# EAGLE design sapphire_tx_board (EAGLE 5.11)
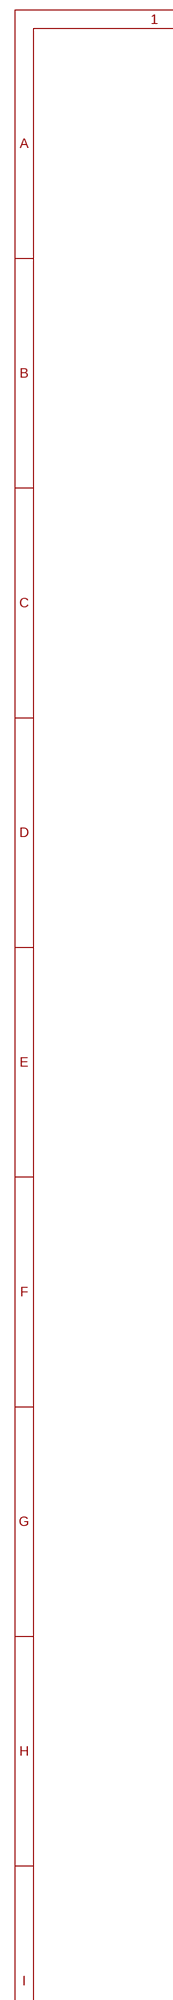
[diagram p0: schematic, sheet 1, part 1 of 2]
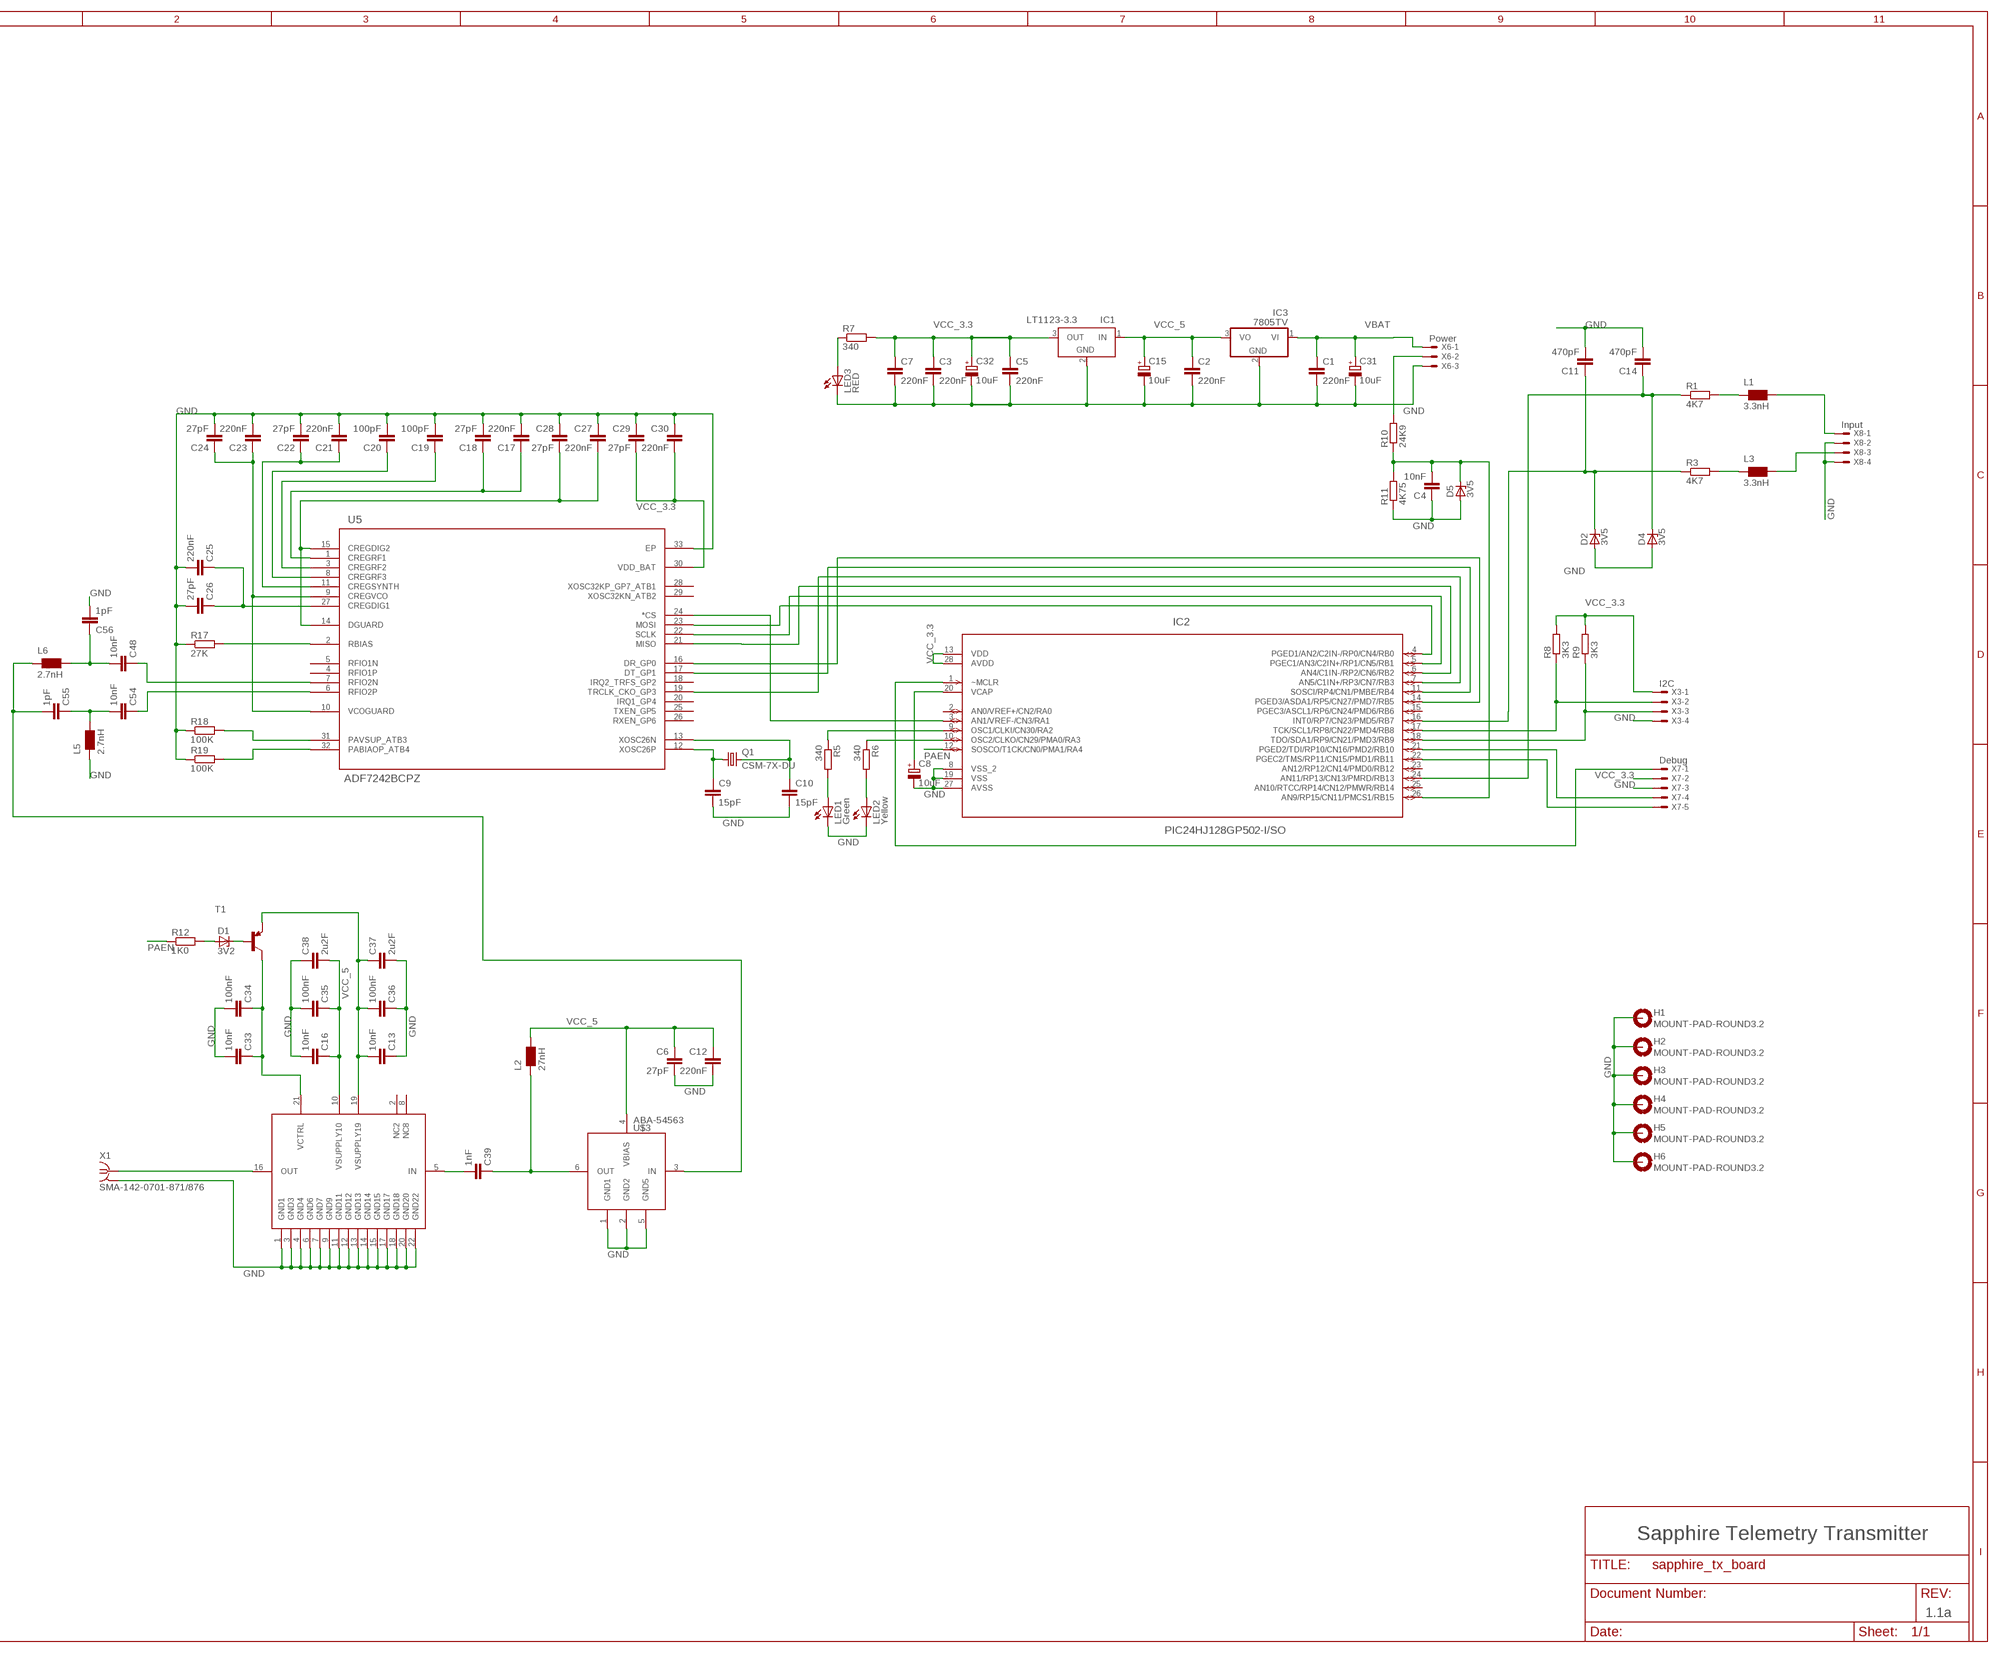
[diagram p1: schematic, sheet 1, part 2 of 2]

## Parts
C1  220nF  C-EUC1206  [C1206]
C2  220nF  C-EUC1206  [C1206]
C3  220nF  C-EUC1206  [C1206]
C4  10nF  C-EUC1206  [C1206]
C5  220nF  C-EUC1206  [C1206]
C6  27pF  C-EUC0603  [C0603]
C7  220nF  C-EUC1206  [C1206]
C8  10uF  CPOL-EUCT6032  [CT6032]
C9  15pF  C-EUC0805  [C0805]
C10  15pF  C-EUC0805  [C0805]
C11  470pF  C-EUC1206  [C1206]
C12  220nF  C-EUC0603  [C0603]
C13  10nF  C-EUC0402  [C0402]
C14  470pF  C-EUC1206  [C1206]
C15  10uF  CPOL-EUCT6032  [CT6032]
C16  10nF  C-EUC0402  [C0402]
C17  220nF  C-EUC0603  [C0603]
C18  27pF  C-EUC0603  [C0603]
C19  100pF  C-EUC0603  [C0603]
C20  100pF  C-EUC0603  [C0603]
C21  220nF  C-EUC0603  [C0603]
C22  27pF  C-EUC0603  [C0603]
C23  220nF  C-EUC0603  [C0603]
C24  27pF  C-EUC0603  [C0603]
C25  220nF  C-EUC0603  [C0603]
C26  27pF  C-EUC0603  [C0603]
C27  220nF  C-EUC0603  [C0603]
C28  27pF  C-EUC0603  [C0603]
C29  27pF  C-EUC0603  [C0603]
C30  220nF  C-EUC0603  [C0603]
C31  10uF  CPOL-EUCT6032  [CT6032]
C32  10uF  CPOL-EUCT6032  [CT6032]
C33  10nF  C-EUC0402  [C0402]
C34  100nF  C-EUC0402  [C0402]
C35  100nF  C-EUC0402  [C0402]
C36  100nF  C-EUC0402  [C0402]
C37  2u2F  C-EUC1206  [C1206]
C38  2u2F  C-EUC1206  [C1206]
C39  1nF  C-EUC0402  [C0402]
C48  10nF  C-EUC0402  [C0402]
C54  10nF  C-EUC0402  [C0402]
C55  1pF  C-EUC0402  [C0402]
C56  1pF  C-EUC0402  [C0402]
D1  3V2  ZENER-DIODESMB  [SMB]
D2  3V5  ZENER-DIODESMB  [SMB]
D4  3V5  ZENER-DIODESMB  [SMB]
D5  3V5  ZENER-DIODESMB  [SMB]
H1  MOUNT-PAD-ROUND3.2  [3,2-PAD]
H2  MOUNT-PAD-ROUND3.2  [3,2-PAD]
H3  MOUNT-PAD-ROUND3.2  [3,2-PAD]
H4  MOUNT-PAD-ROUND3.2  [3,2-PAD]
H5  MOUNT-PAD-ROUND3.2  [3,2-PAD]
H6  MOUNT-PAD-ROUND3.2  [3,2-PAD]
IC1  LT1123-3.3  LT1129CST5  [SOT223]
IC2  PIC24HJ128GP502-I/SO  [SOIC127P1030X265-28N]
IC3  7805TV  [TO220V]
L1  3.3nH  WE-KI_0805_B  [WE-KI_0805_B]
L2  27nH  WE-KI_0402_B  [WE-KI_0402_B]
L3  3.3nH  WE-KI_0805_B  [WE-KI_0805_B]
L5  2.7nH  WE-KI_0402_B  [WE-KI_0402_B]
L6  2.7nH  WE-KI_0402_B  [WE-KI_0402_B]
LED1  Green  LEDCHIPLED_1206  [CHIPLED_1206]
LED2  Yellow  LEDCHIPLED_1206  [CHIPLED_1206]
LED3  RED  LEDCHIPLED_1206  [CHIPLED_1206]
Q1  CSM-7X-DU  [CSM-7X-DU]
R1  4K7  R-EU_M1206  [M1206]
R3  4K7  R-EU_M1206  [M1206]
R5  340  R-EU_R1206  [R1206]
R6  340  R-EU_R1206  [R1206]
R7  340  R-EU_M1206  [M1206]
R8  3K3  R-EU_M1206  [M1206]
R9  3K3  R-EU_M1206  [M1206]
R10  24K9  R-EU_M1206  [M1206]
R11  4K75  R-EU_M1206  [M1206]
R12  1K0  R-EU_R1206  [R1206]
R17  27K  R-EU_M0805  [M0805]
R18  100K  R-EU_M0805  [M0805]
R19  100K  R-EU_M0805  [M0805]
T1  -PNP-SOT23-BCE  [SOT23-BCE]
U5  ADF7242BCPZ  [CP_32_13]
U$3  ABA-54563  [SOT-363]
U$4  ALM-31222  [ALM-31222]
X1  SMA-142-0701-871/876  [J502-ND-142-0701-871/876]
X3  I2C  22-23-2041  [22-23-2041]
X6  Power  22-23-2031  [22-23-2031]
X7  Debug  22-23-2051  [22-23-2051]
X8  Input  22-23-2041  [22-23-2041]

## Nets
3.3V_GPIP171_SPI1_CLK: IC2.7(AN5/C1IN+/RP3/CN7/RB3) U5.19(TRCLK_CKO_GP3)
GND [supply]: C1.2 C2.2 C3.2 C4.1 C5.2 C6.2 C7.2 C8.- C9.2 C10.2 C11.2 C12.2 C13.1 C14.2 C15.- C16.2 C17.2 C18.2 C19.2 C20.2 C21.2 C22.2 C23.2 C24.2 C25.2 C26.2 C27.1 C28.1 C29.1 C30.1 C31.- C32.- C33.2 C34.2 C35.2 C36.1 C37.2 C38.1 C56.2 D2.A D4.A D5.A H1.B3,2(MOUNT) H2.B3,2(MOUNT) H3.B3,2(MOUNT) H4.B3,2(MOUNT) H5.B3,2(MOUNT) H6.B3,2(MOUNT) IC1.2(GND) IC2.8(VSS_2) IC2.19(VSS) IC2.27(AVSS) IC3.2(GND) L5.2 LED1.C LED2.C LED3.C R11.1 R17.1 R18.1 R19.1 U5.33(EP) U$3.1(GND1) U$3.2(GND2) U$3.5(GND5) U$4.1(GND1) U$4.3(GND3) U$4.4(GND4) U$4.6(GND6) U$4.7(GND7) U$4.9(GND9) U$4.11(GND11) U$4.12(GND12) U$4.13(GND13) U$4.14(GND14) U$4.15(GND15) U$4.17(GND17) U$4.18(GND18) U$4.20(GND20) U$4.22(GND22) X1.G@1(GND) X3.4 X6.3 X7.3 X8.2 X8.4
N$1: IC2.14(PGED3/ASDA1/RP5/CN27/PMD7/RB5) U5.16(DR_GP0)
N$2: C10.1 Q1.2 U5.13(XOSC26N)
N$3: IC2.1(~MCLR) X7.1
N$4: IC2.4(PGED1/AN2/C2IN-/RP0/CN4/RB0) U5.23(MOSI)
N$5: IC2.5(PGEC1/AN3/C2IN+/RP1/CN5/RB1) U5.22(SCLK)
N$6: IC2.3(AN1/VREF-/CN3/RA1) U5.24(*CS)
N$7: IC2.21(PGED2/TDI/RP10/CN16/PMD2/RB10) X7.4
N$8: IC2.22(PGEC2/TMS/RP11/CN15/PMD1/RB11) X7.5
N$9: IC2.18(TDO/SDA1/RP9/CN21/PMD3/RB9) R9.1 X3.3
N$10: IC2.17(TCK/SCL1/RP8/CN22/PMD4/RB8) R8.1 X3.2
N$11: IC2.11(SOSCI/RP4/CN1/PMBE/RB4) U5.17(DT_GP1)
N$12: IC2.6(AN4/C1IN-/RP2/CN6/RB2) U5.21(MISO)
N$13: C9.1 Q1.1 U5.12(XOSC26P)
N$14: C14.1 D4.C IC2.24(AN11/RP13/CN13/PMRD/RB13) R1.1
N$15: C39.1 L2.2 U$3.6(OUT)
N$16: C39.2 U$4.5(IN)
N$17: C11.1 D2.C IC2.16(INT0/RP7/CN23/PMD5/RB7) R3.1
N$18: C17.1 C18.1 U5.1(CREGRF1)
N$19: R17.2 U5.2(RBIAS)
N$20: C19.1 U5.3(CREGRF2)
N$21: C20.1 U5.8(CREGRF3)
N$22: C21.1 C22.1 U5.11(CREGSYNTH)
N$23: C23.1 C24.1 U5.9(CREGVCO) U5.10(VCOGUARD)
N$24: C25.1 C26.1 U5.27(CREGDIG1)
N$25: C27.2 C28.2 U5.14(DGUARD) U5.15(CREGDIG2)
N$26: R18.2 U5.31(PAVSUP_ATB3)
N$27: R19.2 U5.32(PABIAOP_ATB4)
N$28: L3.2 R3.2
N$29: U$4.16(OUT) X1.1
N$30: IC2.10(OSC2/CLKO/CN29/PMA0/RA3) R6.1
N$31: IC2.9(OSC1/CLKI/CN30/RA2) R5.1
N$32: L1.1 X8.1
N$33: C8.+ IC2.20(VCAP)
N$34: C13.2 C36.2 C37.1 T1.E U$4.19(VSUPPLY19)
N$35: L3.1 X8.3
N$36: D1.C T1.B
N$37: C4.2 D5.C IC2.26(AN9/RP15/CN11/PMCS1/RB15) R10.1 R11.2
N$38: R10.2 X6.2
N$39: L1.2 R1.2
N$40: C33.1 C34.1 T1.C U$4.21(VCTRL)
N$41: D1.A R12.2
N$42: LED2.A R6.2
N$43: LED1.A R5.2
N$45: LED3.A R7.1
N$46: C48.1 U5.7(RFIO2N)
N$47: C54.1 U5.6(RFIO2P)
N$48: C54.2 C55.1 L5.1
N$49: C48.2 C56.1 L6.1
N$50: C55.2 L6.2 U$3.3(IN)
PAEN: IC2.12(SOSCO/T1CK/CN0/PMA1/RA4) R12.1
VBAT: C1.1 C31.+ IC3.1(VI) X6.1
VCC_3.3 [supply]: C3.1 C5.1 C7.1 C29.2 C30.2 C32.+ IC1.3(OUT) IC2.13(VDD) IC2.28(AVDD) R7.2 R8.2 R9.2 U5.30(VDD_BAT) X3.1 X7.2
VCC_5: C2.1 C6.1 C12.1 C15.+ C16.1 C35.1 C38.2 IC1.1(IN) IC3.3(VO) L2.1 U$3.4(VBIAS) U$4.10(VSUPPLY10)
Unconnected: IC2.2(AN0/VREF+/CN2/RA0) IC2.15(PGEC3/ASCL1/RP6/CN24/PMD6/RB6) IC2.23(AN12/RP12/CN14/PMD0/RB12) IC2.25(AN10/RTCC/RP14/CN12/PMWR/RB14) U5.4(RFIO1P) U5.5(RFIO1N) U5.18(IRQ2_TRFS_GP2) U5.20(IRQ1_GP4) U5.25(TXEN_GP5) U5.26(RXEN_GP6) U5.28(XOSC32KP_GP7_ATB1) U5.29(XOSC32KN_ATB2) U$4.2(NC2) U$4.8(NC8)

## Notes on the sheet
- Sapphire Telemetry Transmitter
- 1.1a

## Power pins joined to a net without a drawn wire
GND: IC1.4(GND) X1.G@2(GND) X1.G@3(GND) X1.G@4(GND)

## Library data of the parts
C1-C7 C9-C14 C16-C30 C33-C39 C48 C54-C56 = resistor:C-EU: CAPACITOR, European symbol
C8 C15 C31 C32 = resistor:CPOL-EU: POLARIZED CAPACITOR, European symbol
D1 D2 D4 D5 = diode:ZENER-DIODE: Z-Diode
H1-H6 = holes:MOUNT-PAD-ROUND: MOUNTING PAD, round
IC1 = linear-technology:LT1129CST5: VOLTAGE REGULATOR with shutdown; MPN: LT1129CST-5#PBF; OC_FARNELL: 1663375; OC_NEWARK: 57M2069
IC2 = Microchip-PIC24HJ127GP502-soic:PIC24HJ128GP502-I/SO: 16-bit Microcontrollers; DESCRIPTION: 16-bit Microcontrollers; MPN: PIC24HJ128GP502-I/SO; OC_FARNELL: 1576880; OC_NEWARK: 40M1488; PACKAGE: SOIC-28; SUPPLIER: Microchip
IC3 = linear:78*: Positive VOLTAGE REGULATOR Source: http://cache.national.com/ds/LM/LM78L05.pdf http://www.fairchildsemi.com/ds/LM/LM7805.pdf
L1-L3 L5 L6 = wuerth-elektronik:WE-KI: SMD Wire Wound Ceramic Inductor WE-KI - Wire wound - High thermal stability - Rated current up to 1 A - High Q-factor - High SRF -- Especially developed for high frequency applications -- Perfect for applications in telecommunications -- Bluetooth -- Wireless LAN
LED1-LED3 = led:LED: LED OSRAM: - CHIPLED LG R971, LG N971, LY N971, LG Q971, LY Q971, LO R971, LY R971 LH N974, LH R974 LS Q976, LO Q976, LY Q976 LO Q996 - Hyper CHIPLED LW Q18S LB Q993, LB Q99A, LB R99A - SideLED LS A670, LO A670, LY A670, LG A670, LP A670 LB A673, LV A673, LT A673, LW A673 LH A674 LY A675 LS A676, LA A676, LO A676, LY A676, LW A676 LS A679, LY A679, LG A679 - Hyper Micro SIDELED® LS Y876, LA Y876, LO Y876, LY Y876 LT Y87S - SmartLED LW L88C, LW L88S LB L89C, LB L89S, LG L890 LS L89K, LO L89K, LY L89K LS L896, LA L896, LO L896, LY L896 - TOPLED LS T670, LO T670, LY T670, LG T670, LP T670 LSG T670, LSP T670, LSY T670, LOP T670, LYG T670 LG T671, LOG T671, LSG T671 LB T673, LV T673, LT T673, LW T673 LH T674 LS T676, LA T676, LO T676, LY T676, LB T676, LH T676, LSB T676, LW T676 LB T67C, LV T67C, LT T67C, LS T67K, LO T67K, LY T67K, LW E67C LS E67B, LA E67B, LO E67B, LY E67B, LB E67C, LV E67C, LT E67C LW T67C LS T679, LY T679, LG T679 LS T770, LO T770, LY T770, LG T770, LP T770 LB T773, LV T773, LT T773, LW T773 LH T774 LS E675, LA E675, LY E675, LS T675 LS T776, LA T776, LO T776, LY T776, LB T776 LHGB T686 LT T68C, LB T68C - Hyper Mini TOPLED® LB M676 - Mini TOPLED Santana® LG M470 LS M47K, LO M47K, LY M47K Source: http://www.osram.convergy.de LUXEON: - LUMILED® LXK2-PW12-R00, LXK2-PW12-S00, LXK2-PW14-U00, LXK2-PW14-V00 LXK2-PM12-R00, LXK2-PM12-S00, LXK2-PM14-U00 LXK2-PE12-Q00, LXK2-PE12-R00, LXK2-PE12-S00, LXK2-PE14-T00, LXK2-PE14-U00 LXK2-PB12-K00, LXK2-PB12-L00, LXK2-PB12-M00, LXK2-PB14-N00, LXK2-PB14-P00, LXK2-PB14-Q00 LXK2-PR12-L00, LXK2-PR12-M00, LXK2-PR14-Q00, LXK2-PR14-R00 LXK2-PD12-Q00, LXK2-PD12-R00, LXK2-PD12-S00 LXK2-PH12-R00, LXK2-PH12-S00 LXK2-PL12-P00, LXK2-PL12-Q00, LXK2-PL12-R00 Source: www.luxeon.com KINGBRIGHT: KA-3528ASYC Source: www.kingbright.com
Q1 = crystal:CSM-7X-DU: SMD CRYSTAL Source: www.ecsxtal.com .. Crystal 3.6864MHz CSM_7X_DU.PDF; OC_FARNELL: unknown; OC_NEWARK: unknown
R1 R3 R5-R12 R17-R19 = resistor:R-EU_: RESISTOR, European symbol
T1 = transistor:*-PNP-: PNP Transistror
U5 = Analog-ADF7242:ADF7242BCPZ
U$3 = Agilent:ABA-54563
U$4 = Avago:ALM-31222
X1 = con-coax:SMA-: SMA 50 Ohm End Launch Jack Receptacle - Round Contact Johnson Components Source: www.johnsoncomponents.com .. J502-ND.pdf; MF: JOHNSON COMPONENTS; MPN: 142-0701-871; OC_FARNELL: 1339835; OC_NEWARK: 91B6105
X3 X8 = con-molex:22-23-2041: .100" (2.54mm) Center Header - 4 Pin; MF: MOLEX; MPN: 22-23-2041; OC_FARNELL: 1462920; OC_NEWARK: 38C0355
X6 = con-molex:22-23-2031: .100" (2.54mm) Center Header - 3 Pin; MF: MOLEX; MPN: 22-23-2031; OC_FARNELL: 1462950; OC_NEWARK: 30C0862
X7 = con-molex:22-23-2051: .100" (2.54mm) Center Header - 5 Pin; MF: MOLEX; MPN: 22-23-2051; OC_FARNELL: 1462952; OC_NEWARK: 38C9178

## Net classes
4 xxwide: width 0.203 mm

## Board
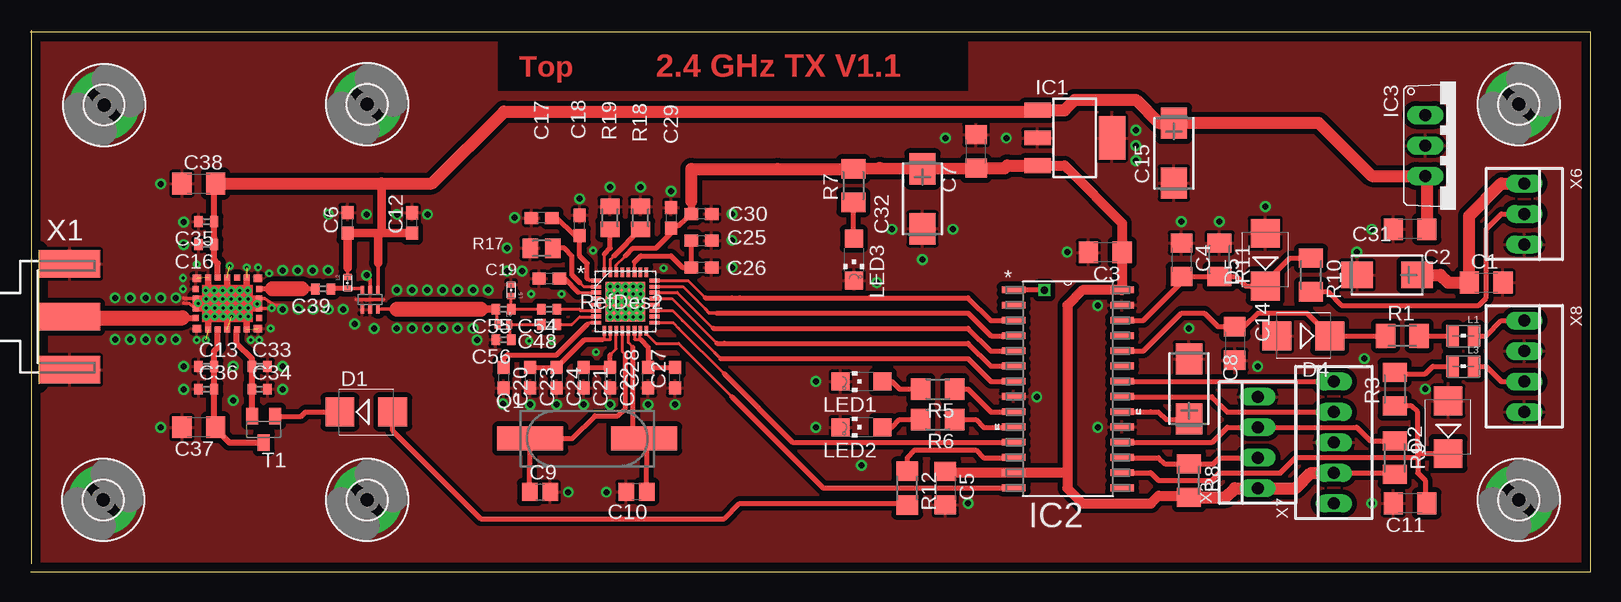
[diagram p2: board, top side]
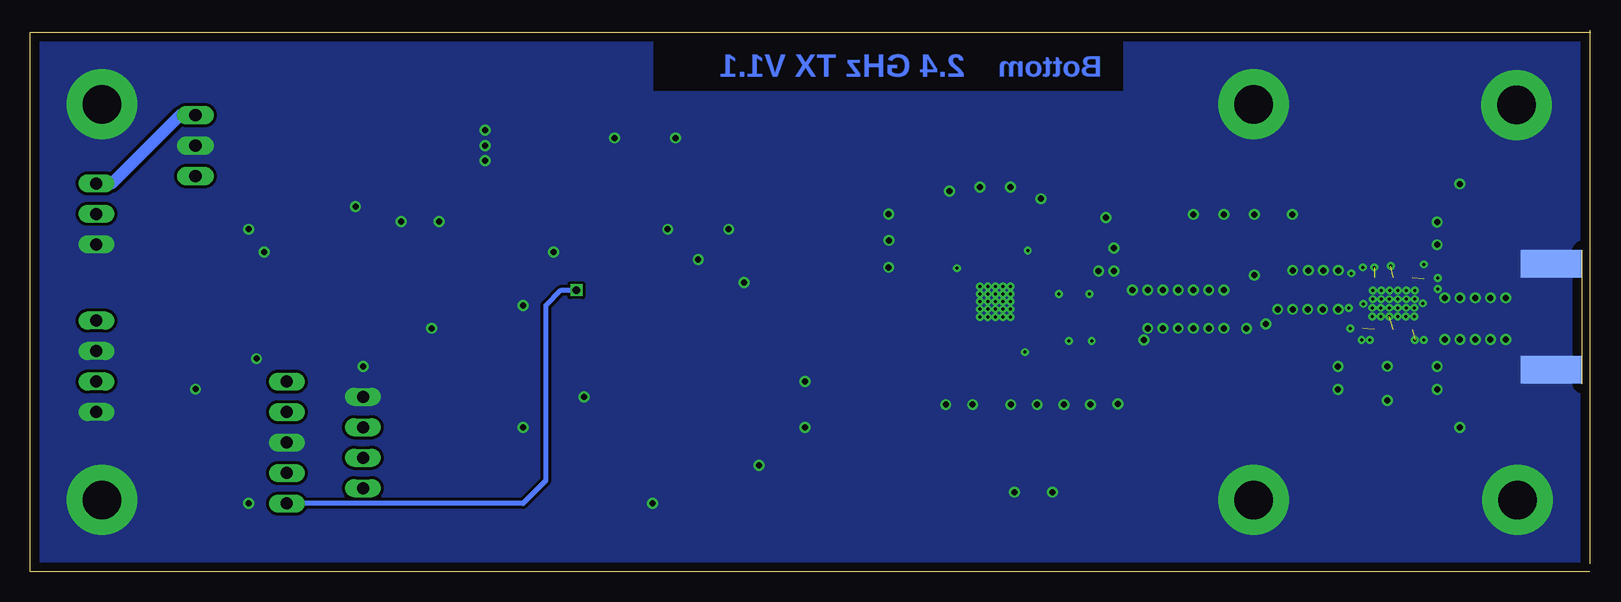
[diagram p3: board, bottom side, seen from below]

Size 130.1 x 45.2 mm. Coordinates in mm from the lower left corner, seen from the top.
Outline: 0.07,0 130.1,0 130.1,45 0,45.03
Outline: 0.1,45.2 0.1,0.68
Copper layers (1*16): Top 0.035mm / dielectric 1.5mm / Bottom 0.035mm
Design rules "default *": minimum track width 9mil, minimum drill 0.25mm, track to track 6mil, track to pad 6mil, pad to pad 6mil, via to via 8mil, smd to smd 6mil, copper to edge 30mil, drill to drill 7mil, minimum pad ring 10mil, minimum via ring 8mil, stop-mask expansion 4mil, vias tented up to drill 2mm, thermal gap 10mil

### Footprints (pad centres in the part's own frame; a part is rotated, then mirrored left to right if it is on the bottom)
C1206 = smd 1.6 x 1.8: 1 -1.4,0; 2 1.4,0
C0603 = smd 1.1 x 1: 1 -0.85,0; 2 0.85,0
CT6032 = smd 2.6 x 2.2: + 2.5,0; - -2.5,0
C0805 = smd 1.3 x 1.5: 1 -0.85,0; 2 0.85,0
C0402 = smd 0.7 x 0.9: 1 -0.65,0; 2 0.65,0
SMB = smd 2.4 x 2.4: A 2.2,0; C -2.2,0
3,2-PAD = drill 3.2 pad 5.842 round: B3,2 0,0
SOT223 = smd 1.219 x 2.235: 1 -2.311,-3.099; 2 0,-3.099; 3 2.311,-3.099 | smd 3.6 x 2.2: 4 0,3.099
SOIC127P1030X265-28N = smd 1.981 x 0.559: 1 -4.521,8.255; 2 -4.521,6.985; 3 -4.521,5.715; 4 -4.521,4.445; 5 -4.521,3.175; 6 -4.521,1.905; 7 -4.521,0.635; 8 -4.521,-0.635; 9 -4.521,-1.905; 10 -4.521,-3.175; 11 -4.521,-4.445; 12 -4.521,-5.715; 13 -4.521,-6.985; 14 -4.521,-8.255; 15 4.521,-8.255; 16 4.521,-6.985; 17 4.521,-5.715; 18 4.521,-4.445; 19 4.521,-3.175; 20 4.521,-1.905; 21 4.521,-0.635; 22 4.521,0.635; 23 4.521,1.905; 24 4.521,3.175; 25 4.521,4.445; 26 4.521,5.715; 27 4.521,6.985; 28 4.521,8.255
TO220V = drill 1.016 long: 1 -2.54,-2.54; 2 0,-2.54; 3 2.54,-2.54
WE-KI_0805_B = smd 1.02 x 1.78: 1 -0.89,0; 2 0.89,0
WE-KI_0402_B = smd 0.5 x 0.66: 1 -0.48,0; 2 0.48,0
CHIPLED_1206 = smd 1.5 x 1.5: A 0,-1.75; C 0,1.75
CSM-7X-DU = smd 5.5 x 2: 1 -4.75,0; 2 4.75,0
M1206 = smd 1.6 x 2: 1 -1.4,0; 2 1.4,0
R1206 = smd 1.6 x 1.803: 1 -1.422,0; 2 1.422,0
M0805 = smd 1.3 x 1.6: 1 -0.95,0; 2 0.95,0
SOT23-BCE = smd 1 x 1.4: B -0.95,-1.1; C 0.95,-1.1; E 0,1.1
CP_32_13 = smd 0.813 x 0.305: 1 -2.438,1.753; 2 -2.438,1.245; 3 -2.438,0.762; 4 -2.438,0.254; 5 -2.438,-0.254; 6 -2.438,-0.762; 7 -2.438,-1.245; 8 -2.438,-1.753; 17 2.438,-1.753; 18 2.438,-1.245; 19 2.438,-0.762; 20 2.438,-0.254; 21 2.438,0.254; 22 2.438,0.762; 23 2.438,1.245; 24 2.438,1.753 | smd 0.305 x 0.813: 9 -1.753,-2.438; 10 -1.245,-2.438; 11 -0.762,-2.438; 12 -0.254,-2.438; 13 0.254,-2.438; 14 0.762,-2.438; 15 1.245,-2.438; 16 1.753,-2.438; 25 1.753,2.438; 26 1.245,2.438; 27 0.762,2.438; 28 0.254,2.438; 29 -0.254,2.438; 30 -0.762,2.438; 31 -1.245,2.438; 32 -1.753,2.438 | smd 3.302 x 3.302: 33 0,0
SOT-363 = smd 0.3 x 0.7: 1 -0.65,-0.8; 2 0,-0.8; 3 0.65,-0.8; 4 0.65,0.8; 5 0,0.8; 6 -0.65,0.8
ALM-31222 = smd 0.7 x 0.6: 1 -2.55,2.1; 6 -2.55,-2.1; 12 2.55,-2.1; 17 2.55,2.1 | smd 0.5 x 0.5: 2 -2.65,1.2; 3 -2.65,0.4; 4 -2.65,-0.4; 5 -2.65,-1.2; 7 -1.6,-2.15; 8 -0.8,-2.15; 9 0,-2.15; 10 0.8,-2.15; 11 1.6,-2.15; 13 2.65,-1.2; 14 2.65,-0.4; 15 2.65,0.4; 16 2.65,1.2; 18 1.6,2.15; 19 0.8,2.15; 20 0,2.15; 21 -0.8,2.15; 22 -1.6,2.15
J502-ND-142-0701-871/876 = smd 5.08 x 2.286: 1 2.565,0; G@1 2.565,4.42; G@2 2.565,-4.42 | smd 5.08 x 2.286 bottom: G@3 2.565,4.42; G@4 2.565,-4.42
22-23-2041 = drill 1 long: 1 -3.81,0; 2 -1.27,0; 3 1.27,0; 4 3.81,0
22-23-2031 = drill 1 long: 1 -2.54,0; 2 0,0; 3 2.54,0
22-23-2051 = drill 1 long: 1 -5.08,0; 2 -2.54,0; 3 0,0; 4 2.54,0; 5 5.08,0

### Placement (x,y rotation side)
C1  121.38,24.13 0 top
C2  115.03,28.57 180 top
C3  89.63,26.65 180 top
C4  95.98,26.04 270 top
C5  76.3,6.99 270 top
C6  26.47,29.11 90 top
C7  78.86,35.06 90 top
C8  96.61,15.25 270 top
C9  42.52,6.67 0 top
C10  50.55,6.68 180 top
C11  115.03,5.71 180 top
C12  31.85,29.1 90 top
C13  14.71,17.14 0 top
C14  100.43,19.05 270 top
C15  95.35,34.92 90 top
C16  14.71,27.3 180 top
C17  42.65,29.53 180 top
C18  45.82,28.89 90 top
C19  43.28,24.45 180 top
C20  39.47,16.19 270 top
C21  46.14,16.19 270 top
C22  48.36,16.19 270 top
C23  41.69,16.19 270 top
C24  43.91,16.19 270 top
C25  55.98,27.62 0 top
C26  55.98,25.4 0 top
C27  53.76,16.19 90 top
C28  51.54,16.19 90 top
C29  53.44,29.53 270 top
C30  55.98,29.84 180 top
C31  113.13,24.77 0 top
C32  74.39,31.11 90 top
C33  19.15,17.14 0 top
C34  19.15,15.24 0 top
C35  14.71,29.21 180 top
C36  14.71,15.24 0 top
C37  14.07,12.06 180 top
C38  14.07,32.38 0 top
C39  24.43,23.6 180 top
C48  43.28,20.64 180 top
C54  43.28,21.91 180 top
C55  39.47,21.91 180 top
C56  39.47,19.37 180 top
D1  28.04,13.34 0 top
D2  118.21,12.06 90 top
D4  106.14,19.68 180 top
D5  102.97,26.04 90 top
H1  6.1,6 0 top
H2  6.18,38.94 0 top
H3  124.1,6 0 top
H4  124.1,39 0 top
H5  28.1,6 0 top
H6  28.1,39 0 top
IC1  87.09,36.2 270 top
IC2  86.52,15.26 0 top
IC3  118.84,35.56 270 top
L1  119.48,19.68 180 top
L2  26.47,24.09 270 top
L3  119.48,17.14 180 top
L5  40.11,23.5 90 top
L6  39.47,20.64 180 top
LED1  69.31,15.88 90 top
LED2  69.31,12.06 90 top
LED3  68.68,26.04 180 top
Q1  46.45,11.11 0 top
R1  114.4,19.68 0 top
R3  113.77,15.24 90 top
R5  75.66,15.24 180 top
R6  75.66,12.7 180 top
R7  68.63,32.22 90 top
R8  96.62,7.62 270 top
R9  113.77,9.53 270 top
R10  106.78,24.77 270 top
R11  99.16,26.04 270 top
R12  73.12,6.99 270 top
R17  42.65,26.99 0 top
R18  50.9,29.53 270 top
R19  48.36,29.53 270 top
T1  19.49,11.88 180 top
U5  49.63,22.54 0 top
U$3  28.36,22.7 0 top
U$4  16.45,22.38 180 top
X1  0.73,21.27 0 top
X3  102.33,10.79 90 top
X6  124.56,29.84 270 top
X7  108.68,10.79 90 top
X8  124.56,17.14 270 top

### Tracks (layer width: path | path; a pad name or v marks a point on that pad's centre or on a via)
3.3V_GPIP171_SPI1_CLK
  Top 0.254: U5.19 53.57,21.78 54.39,20.95 57.09,18.26
  Top 0.305: 57.09,18.26 57.57,17.78
  Top 0.406: IC2.7 80.13,15.9 80.11,15.88 78.2,17.78 57.88,17.78 57.57,17.78
GND  (via drill 0.25, 0.5)  (6 unrouted)
  Top 0.305: U$4.15 13.29,22.38 12.8,22.43 | U$4.14 12.88,22.78 12.8,22.86 | U$4.4 19.56,22.78 20.42,22.23 | 20.42,22.23 21.05,22.23 20.42,22.23 | U$4.3 20.18,21.98 20.42,22.23 | U$3.2 | U$3.5 28.36,24.43 v28.05,24.74 | 27.21,22.71 29.5,22.71
  other vias: 10.89,19.39 9.62,19.39 12.16,19.39 9.62,22.86 10.89,22.86 12.16,22.86 8.36,22.86 7.08,22.86 7.08,19.39 8.36,19.39 49.63,22.54 50.9,32.09 48.36,32.1 45.82,31.11 53.44,31.75 58.52,29.84 58.5,27.65 58.52,25.4 40.4,29.55 39.75,27 41.02,25.09 39.75,25.09 37.25,19.35 39.42,14.02 41.7,13.95 43.9,13.95 46.15,13.95 48.34,13.95 51.52,13.95 53.77,13.95 48.05,6.65 44.87,6.65 65.5,15.88 65.5,12.06 70.58,24.13 74.39,26.04 78.2,5.71 83.92,14.61 89,12.06 89,22.23 86.46,26.67 95.98,29.21 99.16,29.21 102.97,30.48 111.86,28.57 110.59,26.67 96.62,20.32 102.33,17.14 92.17,36.83 92.17,35.56 92.17,34.29 81.38,36.2 76.3,36.2 28.69,20.31 27.07,20.66 33.12,29.82 28.05,29.82 24.87,29.82 10.9,32.36 12.8,29.18 12.8,27.28 12.8,17.12 12.8,15.21 10.9,12.04 21.06,15.21 16.95,17.15 16.95,14.3 21.06,17.12 18.94,22.36 14,22.4 14.7,21.3 15.4,21.3 16.1,21.3 16.8,21.3 17.5,21.3 18.2,21.3 13.9,25.65 12.75,24.5 12.75,23.6 14.65,19.35 13.9,19.35 18.4,19.35 19.1,19.35 20.05,20.3 20.15,22 19,25.4 19.95,24.9 18.05,25.4 16.66,25.5 21.05,21.9 22.35,21.9 23.6,21.9 24.85,21.9 26.1,21.9 21.05,25.15 22.3,25.15 23.55,25.15 24.85,25.15 30.58,20.32 31.85,20.32 33.12,20.32 34.39,20.32 35.66,20.32 36.93,20.32 30.58,23.5 31.85,23.5 33.12,23.5 34.39,23.5 35.66,23.5 36.93,23.5 38.2,23.5 30.59,29.82 50.27,22.54 50.9,22.54 49,22.54 48.36,22.54 48.36,23.18 48.36,23.81 49,23.81 49.63,23.81 50.27,23.81 50.9,23.81 50.9,23.18 50.27,23.18 49.63,23.18 49,23.18 48.36,21.91 49,21.91 49.63,21.91 50.27,21.91 50.9,21.91 50.9,21.27 50.27,21.27 49.63,21.27 49,21.27 48.36,21.27 71.85,28.57 76.93,28.57 43.5,19.27 41.59,19.27 44.32,23.17 41.78,23.17 47.17,18.32 46.93,26.81 52.82,25.32 111.86,5.71 116.3,15.24 111.22,17.78 69.31,8.89 14.66,23.46 15.37,23.46 16.07,23.46 16.77,23.46 17.46,23.46 18.17,23.46 14.67,22.74 15.38,22.74 16.07,22.74 16.78,22.74 17.48,22.74 18.18,22.74 14.69,22.02 15.39,22.02 16.09,22.02 16.79,22.02 17.49,22.02 18.19,22.02
  pour Bottom (isolate 0.254, no thermals): 130.1,45 78.3,45 78.3,40.01 38.84,40.01 38.84,45 0.1,45 0.1,0 130.1,0
  pour Top (isolate 0.406): 0.05,45.06 38.84,45.06 38.84,40.01 78.35,40.01 78.35,45 130.11,45.01 130.1,0 0.1,0
  pour Top (no thermals): 2,43.18 2,34.92 10.26,34.92 10.26,43.18
  pour Top (no thermals): 24.23,42.55 31.85,42.55 31.85,35.56 24.23,35.56
  pour Top (no thermals): 2.64,10.16 2.64,1.91 9.62,1.91 9.62,10.16
  pour Top (no thermals): 29.95,9.53 32.48,6.35 32.48,2.54 24.23,2.54 24.23,9.53
  pour Top (no thermals): 121.38,9.53 120.11,6.99 120.11,1.91 127.73,1.91 127.73,9.53
  pour Top (no thermals): 120.11,42.55 127.73,42.55 127.73,35.56 120.11,35.56
N$1
  Top 0.254: U5.16 51.38,19.84 52.17,19.05 54.08,19.05 58.52,14.61
  Top 0.406: IC2.14 66.12,7.01 64.23,8.89 58.52,14.61
N$2
  Top 0.254: U5.13 49.88,19.11 50.27,18.73 | Q1.2 50.9,11.11
  Top 0.406: 50.27,18.73 50.27,12.38 50.27,11.75 50.9,11.11 | C10.1 51.42,10.9 Q1.2
N$3  (via drill 0.6)
  Top 0.406: IC2.1 84.53,23.52 arc-90 v84.55,23.5
  Bottom 0.406: v84.55,23.5 85.82,23.5 87.09,22.23 87.09,7.62 89,5.71 X7.1
N$4
  Top 0.254: U5.23 54.42,23.79 56.3,21.91
  Top 0.305: 56.3,21.91 56.62,21.59 57.25,21.59
  Top 0.406: IC2.4 81.97,19.68 80.11,19.68 78.2,21.59 57.25,21.59
N$5
  Top 0.254: U5.22 53.95,23.3 56.93,20.32
  Top 0.305: 56.93,20.32 56.97,20.3
  Top 0.406: IC2.5 81.97,18.41 80.11,18.41 78.2,20.32 56.97,20.3
N$6
  Top 0.254: U5.24 54.86,24.3 56.3,22.86
  Top 0.406: 56.3,22.86 58.52,22.86 59.16,22.86 69.95,22.86 78.2,22.86 80.11,20.95 81.97,20.95 IC2.3
N$7
  Top 0.406: IC2.21 91.06,14.61 98.52,14.61 99.79,13.34 108.05,13.34 X7.4
N$8
  Top 0.406: IC2.22 91.06,15.88 107.41,15.88 X7.5
N$9
  Top 0.406: IC2.18 98.55,10.82 99.79,12.06 X3.3 110.59,12.06 111.22,11.43 111.73,10.93 R9.1
N$10
  Top 0.406: IC2.17 91.06,9.53 94.08,9.53 94.58,9.02 R8.1 98.66,9.02 99.16,9.53 X3.2
N$11
  Top 0.254: U5.17 53.61,20.79 54.08,20.32 57.88,16.51
  Top 0.406: IC2.11 63.58,10.82 57.88,16.51
N$12
  Top 0.254: U5.21 53.5,22.8 57.25,19.05
  Top 0.406: IC2.6 80.09,17.17 78.2,19.05 57.88,19.05 57.25,19.05
N$13
  Top 0.254: U5.12 49.38,18.35 49.63,18.1
  Top 0.406: 49.63,18.1 49.63,13.65 49,13.02 47.09,13.02 45.19,11.11 Q1.1 41.7,11.21 C9.1
N$14
  Top 0.406: IC2.24 91.06,18.41 92.81,18.41 95.98,21.59 97.89,21.59 99.03,20.45 C14.1 101.19,20.45 102.33,21.59 106.14,21.59 106.44,21.59 D4.C R1.1
N$15
  Top 0.305: U$3.6 27.6,23.61 L2.2
  Top 0.406: L2.2 25.08,23.61 C39.1
N$16
  Top 0.406: C39.2 22.65,23.6 | 20.2,23.6 U$4.5
  Top 1.27: 22.65,23.6 20.2,23.6
N$17
  Top 0.406: IC2.16 93.42,8.28 94.08,7.62 98.52,7.62 99.16,8.26 104.24,8.26 105.51,9.55 115.65,9.55 115.67,9.53 | 115.67,9.87 D2.C | C11.1 116.3,5.84 116.3,7.62 115.67,8.26 115.67,9.53 | 115.67,9.53 115.67,9.87 | R3.1 115.16,13.84 115.67,13.34 115.67,9.87 | 115.67,9.87 115.67,9.57
N$18
  Top 0.254: U5.1 46.61,24.3 46.45,24.45 | C18.1 45.4,28.04 | 43.91,29.53 C17.1
  Top 0.406: 46.45,24.45 46.45,25.72 45.82,26.35 C18.1 | 45.4,28.04 43.91,29.53
N$19
  Top 0.254: U5.2 46.16,23.79 46.14,23.81 45.82,24.13
  Top 0.406: 45.82,24.13 45.19,24.77 45.19,26.35 44.55,26.99 R17.2
N$20
  Top 0.254: 45.69,23.3 U5.3
  Top 0.406: 45.69,23.3 44.55,24.45 C19.1
N$21
  Top 0.254: U5.8 46.61,20.79 46.45,20.64
  Top 0.406: 46.45,20.64 43.91,18.1 39.79,18.1 39.47,17.78 C20.1
N$22
  Top 0.254: U5.11 48.87,18.61 48.36,18.1
  Top 0.406: 48.36,18.1 C22.1 C21.1
N$23
  Top 0.254: U5.10 48.38,19.37 47.73,19.37 arc90 47.88,19.52 U5.9
  Top 0.406: 47.73,19.37 47.09,19.37 46.24,19.37 C24.1 C23.1
N$24
  Top 0.254: U5.27 50.39,25.84
  Top 0.406: 50.39,25.84 50.9,26.35 53.44,26.35 54.39,25.4 C26.1 C25.1
N$25
  Top 0.254: 50.88,19.39 U5.15 | 50.88,19.39 50.9,19.37 | U5.14 50.39,19.39 50.88,19.39
  Top 0.406: 50.9,19.37 51.54,18.73 C28.2 C27.2
N$26
  Top 0.254: U5.31 48.38,26.06 48.68,26.35
  Top 0.406: 48.68,26.35 R18.2
N$27
  Top 0.254: U5.32 47.88,26.5
  Top 0.406: 47.88,26.5 48.36,26.99 R19.2
N$28
  Top 0.406: R3.2 113.89,16.51 116.3,16.51 116.94,17.14 L3.2
N$29
  Top 0.305: X1.1 2.67,21.18
  Top 0.5: 12.71,21.19 U$4.16
  Top 1.27: 2.67,21.18 12.71,21.19
N$30
  Top 0.406: IC2.10 81.97,12.06 79.47,12.06 78.84,12.7 R6.1
N$31
  Top 0.406: IC2.9 81.97,13.34 80.11,13.34 78.2,15.24 R5.1
N$32
  Top 0.406: X8.1 122.66,20.95 121.38,19.68 L1.1
N$33
  Top 0.406: IC2.20 93.42,13.36 93.44,13.34 94.08,13.34 94.71,12.7 96.56,12.7 C8.+
N$34
  Top 0.305: C13.2 arc-90 15.34,16.52 | C37.1 arc-90 15.36,12.18
  Top 0.5: 15.34,16.52 15.34,18.41 15.65,18.73 U$4.19 | C13.2 C36.2 15.36,12.18 | T1.E 16.61,10.78 16.61,10.79 15.47,11.94 C37.1
N$35
  Top 0.406: L3.1 121.38,17.14 122.66,15.88 X8.3
N$36
  Top 0.406: T1.B 22.61,12.98 22.96,13.34 D1.C
N$37
  Top 0.406: IC2.26 91.06,20.95 92.81,20.95 95.98,24.13 C4.2 R11.2 100.56,24.64 101.06,24.13 101.36,23.84 102.33,23.84 | 102.33,23.84 D5.C | R10.1 105,26.16 104.24,25.4 102.67,23.84 102.33,23.84
N$38
  Top 0.406: X6.2 122.66,29.84 121.38,28.57 121.38,22.86 120.75,22.23 109.32,22.23 108.18,23.36 R10.2
N$39
  Top 0.406: R1.2 L1.2
N$40
  Top 0.305: U$4.21
  Top 0.5: U$4.21 17.25,19.05 18.5,17.8 C33.1 C34.1 18.54,15.24 T1.C
N$41
  Top 0.406: R12.2 72.97,5.71 59.16,5.71 57.88,4.45 37.57,4.45 30.24,11.77 D1.A
N$42
  Top 0.406: R6.2 73.12,12.7 72.49,12.7 71.85,12.06 LED2.A
N$43
  Top 0.406: R5.2 72.49,15.24 71.85,15.88 LED1.A
N$45
  Top 0.406: R7.1 68.63,27.84 LED3.A
N$46
  Top 0.254: U5.7 47.17,21.27 45.82,21.27 45.19,20.64 C48.1
N$47
  Top 0.254: U5.6 45.95,21.78 arc-90 45.82,21.91 C54.1
N$48
  Top 0.254: C54.2 C55.1 arc-90 40.11,21.92 L5.1
N$49
  Top 0.254: C48.2 L6.1 C56.1
N$50
  Top 0.254: C55.2 L6.2
  Top 0.305: U$3.3 29.31,21.92 30.58,21.91
  Top 0.635: 37.57,21.92 C55.2
  Top 1.27: 30.58,21.91 37.57,21.92
PAEN
  Top 0.406: IC2.12 81.97,9.53 79.47,9.53 78.84,10.16 73.76,10.16 73.12,9.53 R12.1
VBAT
  Top 1.016: X6.1 122.66,32.38 119.97,29.69 C1.1 118.21,24.13 117.57,24.77 C31.+
  Bottom 1.016: X6.1 123.29,32.38 117.57,38.1 IC3.1
VCC_3.3
  Top 0.254: U5.30 48.87,25.59 49.63,26.35 | 54.71,29.53 C30.2 | C29.2 53.66,28.89
  Top 0.406: 49.63,26.35 50.27,26.99 52.17,26.99 53.44,28.26 C29.2 | 54.71,29.53 54.08,28.89 53.66,28.89 | X7.2 113.63,8.26 arc-90 R9.2
  Top 0.61: C30.2 55.13,30.9
  Top 0.813: 55.13,33.6 55.08,33.66 | 83.28,33.88 86.23,33.88 86.46,33.66 91.03,29.08 C3.1 IC2.28 91.01,23.5 87.73,23.5 86.46,22.23 86.46,8.26 | 86.46,8.26 85.85,8.28 IC2.13 76.41,8.28 C5.1 | R8.2 96.49,6.35 94.08,6.35 93.44,5.71 92.81,5.71 87.73,5.71 86.46,6.99 86.46,8.26
  Top 1.016: 55.13,30.9 55.13,33.6 62.34,33.6 68.61,33.6 R7.2 70.84,33.68 C32.+ 78.38,33.67 C7.1 81.26,33.67 81.47,33.88 83.28,33.88 IC1.3 | X7.2 106.78,8.26 105.51,6.99 X3.1 100.43,6.99 99.66,6.22 R8.2
VCC_5
  Top 0.305: 29,25.77 U$3.4 | C12.1 29.01,28.25 | 26.48,25.35 L2.1 | C6.1
  Top 0.5: U$4.10 15.65,25.72 15.34,26.04 15.34,27.93 C16.1 C35.1 15.36,32.91 C38.2
  Top 0.7: 29,25.77 29.01,28.25 C6.1 | C6.1 26.48,25.35 | C12.1 29.31,28.25 29.31,32.38
  Top 1.016: C38.2 29.31,32.38 33.48,32.38 39.5,38.4 83.89,38.4 IC1.1 86.23,38.51 87.09,39.37 87.4,39.37 92.17,39.37 94.12,37.42 C15.+ 95.39,37.47 107.41,37.47 111.86,33.02 IC3.3 116.43,32.89 C2.1

### Text on the board
Top: Top | 2.4 GHz TX V1.1
Bottom: Bottom | 2.4 GHz TX V1.1